# Altium schematic sheet MOSFETs and Driver.SchDoc
size B
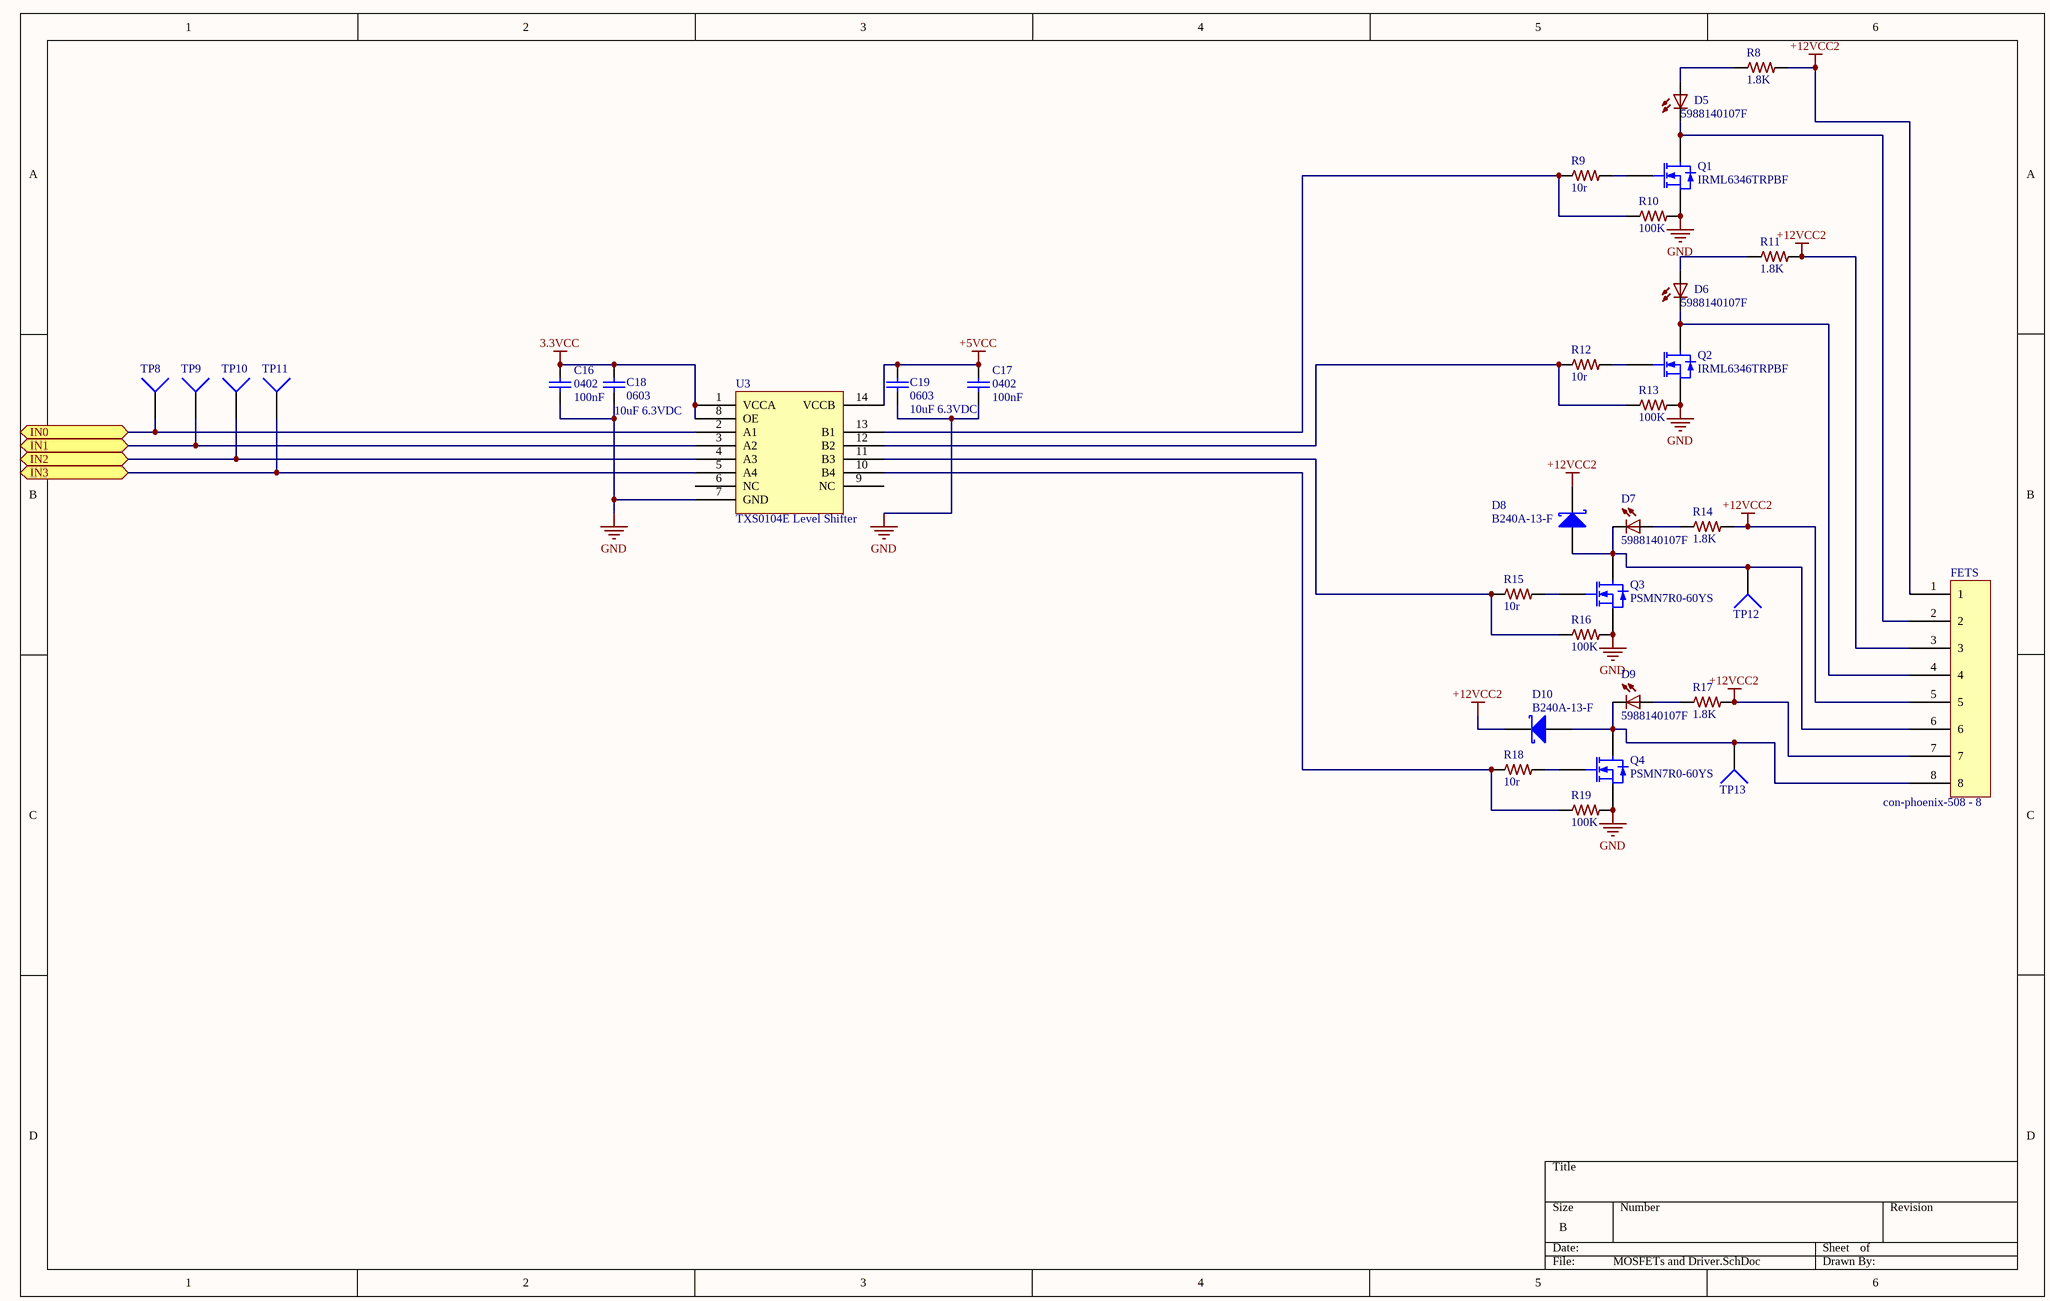
[diagram p0: MOSFETs and Driver.SchDoc]

## Parts
C16  value 100nF  [C0402]  (hidden comment: 0402)
C17  value 100nF  [C0402]  (hidden comment: 0402)
C18  0603  value 10uF 6.3VDC  [C0603]
C19  0603  value 10uF 6.3VDC  [C0603]
D5  5988140107F  [LED2012120]
D6  5988140107F  [LED2012120]
D7  5988140107F  [LED2012120]
D8  B240A-13-F  [SK310A-TP]
D9  5988140107F  [LED2012120]
D10  B240A-13-F  [SK310A-TP]
FETS  con-phoenix-508 - 8  [MSTBV8]
Q1  IRML6346TRPBF  [IRLML6346]
Q2  IRML6346TRPBF  [IRLML6346]
Q3  PSMN7R0-60YS  [PSMN7R0-60YS]
Q4  PSMN7R0-60YS  [PSMN7R0-60YS]
R8  1.8K  [R0603]
R9  10r  [R0603]
R10  100K  [R0603]
R11  1.8K  [R0603]
R12  10r  [R0603]
R13  100K  [R0603]
R14  1.8K  [R0603]
R15  10r  [R0603]
R16  100K  [R0603]
R17  1.8K  [R0603]
R18  10r  [R0603]
R19  100K  [R0603]
TP8  TP4  [TP-2]  (value not drawn)
TP9  TP4  [TP-2]  (value not drawn)
TP10  TP4  [TP-2]  (value not drawn)
TP11  TP4  [TP-2]  (value not drawn)
TP12  TP4  [TP-2]  (value not drawn)
TP13  TP4  [TP-2]  (value not drawn)
U3  TXS0104E Level Shifter  [RGY  (S-PVQFN-N14)]

## Ports
IN0, IN1, IN2, IN3

## Nets
3.3VCC: C16.2 C18.2 U3.1(VCCA) U3.8(OE)
+5VCC: C17.2 C19.2 U3.14(VCCB)
+12VCC2: D8.2(K) D10.2(K) FETS.1 FETS.3 FETS.5 FETS.7 R8.2 R11.2 R14.2 R17.2
GND: C16.1 C17.1 C18.1 C19.1 Q1.2(S) Q2.2(S) Q3.1(S) Q3.2(S) Q3.3(S) Q4.1(S) Q4.2(S) Q4.3(S) R10.2 R13.2 R16.2 R19.2 U3.7(GND)
IN0: TP8.1 U3.2(A1) ; port IN0
IN1: TP9.1 U3.3(A2) ; port IN1
IN2: TP10.1 U3.4(A3) ; port IN2
IN3: TP11.1 U3.5(A4) ; port IN3
NetD5_A: D5.A R8.1
NetD5_C: D5.C FETS.2 Q1.3(D)
NetD6_A: D6.A R11.1
NetD6_C: D6.C FETS.4 Q2.3(D)
NetD7_A: D7.A R14.1
NetD7_C: D7.C D8.1(A) FETS.6 Q3.5(D) TP12.1
NetD9_A: D9.A R17.1
NetD9_C: D9.C D10.1(A) FETS.8 Q4.5(D) TP13.1
NetQ1_1: Q1.1(G) R9.2
NetQ2_1: Q2.1(G) R12.2
NetQ3_4: Q3.4(G) R15.2
NetQ4_4: Q4.4(G) R18.2
NetR9_1: R9.1 R10.1 U3.13(B1)
NetR12_1: R12.1 R13.1 U3.12(B2)
NetR15_1: R15.1 R16.1 U3.11(B3)
NetR18_1: R18.1 R19.1 U3.10(B4)

Not connected (* = marked no-connect by the designer): U3 6(NC) 9(NC)

## Library data of the parts
C16 C17 = GRM155R71C104KA88D: CAP CER 0.1UF (100nF) 16V 10% X7R 0402; MFR: Murata; Part Description: CAP CER 0.1UF 16V 10% X7R 0402; Published: 10 - Dec - 2014; LatestRevisionDate: 10 - Dec - 2014; LatestRevisionNote: Ultimachine Footprint Added; Publisher: Ultimachine; Component Type: Chip Capacitor; MFR Part #: GRM155R71C104KA88D; Mounting Type: SMT 0402; Datasheet: http://psearch.murata.com/capacitor/product/GRM155R71C104KA88%23.pdf; Height: 0.5 ±0.05mm; Tolerance: 10%; Voltage: 16v; PackageReference: 0402
C18 C19 = C1608JB0J106K080AB: CAP CER 10UF 6.3V 10% JB 0603; MFR: TDK; Voltage: 6.3VDC; Published: 10 - Dec - 2014; LatestRevisionDate: 10 - Dec - 2014; Component Type: Chip Capacitor; MFR Part #: C1608JB0J106K080AB; Part Description: CAP CER 10UF 6.3V 10% JB 0603; Mounting Type: SMT 0603; Datasheet: http://www.tdk.com/pdf/TDKMLCCCapRange.pdf; Height: 0.9mm; Tolerance: 10%; Digikey #: 445-11185-1-ND; PackageReference: 0402
D5-D7 D9 = 5988140107F: LED 0805 Yellow; LastRevisionNote: ImportComponents; Published: 23-Apr-2014; Publisher: UltiMachine; LastRevisionDate: 23-Apr-2014; VALUE: 5988140107F
D8 D10 = D Schottky: Schottky Diode; Published: 8-Jun-2000; LatestRevisionDate: 17-Jul-2002; LatestRevisionNote: Re-released for DXP Platform.; PackageReference: SMB; Publisher: Altium Limited; PackageDescription: DO-214-AA/SMB; 2 C-Bend Leads; Body 5.3 x 3.6 mm, inc. leads (LxW); Code_JEDEC: DO-214-AA
FETS = con-phoenix-508
Q1 Q2 = IRML6346TRPBF: N-Channel MOSFET; Published: 8-Jun-2000; LatestRevisionDate: 17-Jul-2002; LatestRevisionNote: Re-released for DXP Platform.; PackageVersion: 1995/1996; PackageReference: E3; Publisher: Altium Limited; PackageDescription: TO, Flat Index; 3 In-Line, Axial Leads; Body Dia. 4.6mm; Lead Dia. 0.5 mm (max)
Q3 Q4 = PSMN7R0-60YS: N-Channel MOSFET; Published: 8-Jun-2000; LatestRevisionDate: 17-Jul-2002; LatestRevisionNote: Re-released for DXP Platform.; PackageVersion: 1995/1996; PackageReference: E3; Publisher: Altium Limited; PackageDescription: TO, Flat Index; 3 In-Line, Axial Leads; Body Dia. 4.6mm; Lead Dia. 0.5 mm (max)
R8 R11 R14 R17 = RC0603JR-071K8L: RES 0603 1.8K 100mW 5%; LastRevisionNote: ImportComponents; Published: 23-Apr-2014; Publisher: UltiMachine; LastRevisionDate: 23-Apr-2014; ManufacturerPartNumber: RC0603JR-071K8L; VALUE: 1.8K
R9 R12 R15 R18 = CRCW060310R0FKEA: RES 0603 10r 100mW 1%; LastRevisionNote: ImportComponents; Published: 23-Apr-2014; Publisher: UltiMachine; LastRevisionDate: 23-Apr-2014; ManufacturerPartNumber: CRCW060310R0FKEA; VALUE: 10r
R10 R13 R16 R19 = RC0603FR-07100KL: RES 100K OHM 1/10W 1% 0603 SMD; LastRevisionNote: ImportComponents; Published: 23-Apr-2014; Publisher: UltiMachine; LastRevisionDate: 23-Apr-2014; ManufacturerPartNumber: RC0603FR-07100KL; VALUE: 100K
TP8-TP13 = Socket: LatestRevisionDate: 17-Jul-2002; LatestRevisionNote: Re-released for DXP Platform.; Publisher: Altium Limited
U3 = TXS0104E: TXS0104E - Bidriectional Opendrain/pushpull level shift